# EAGLE design 100Wdriver (EAGLE 6.2)
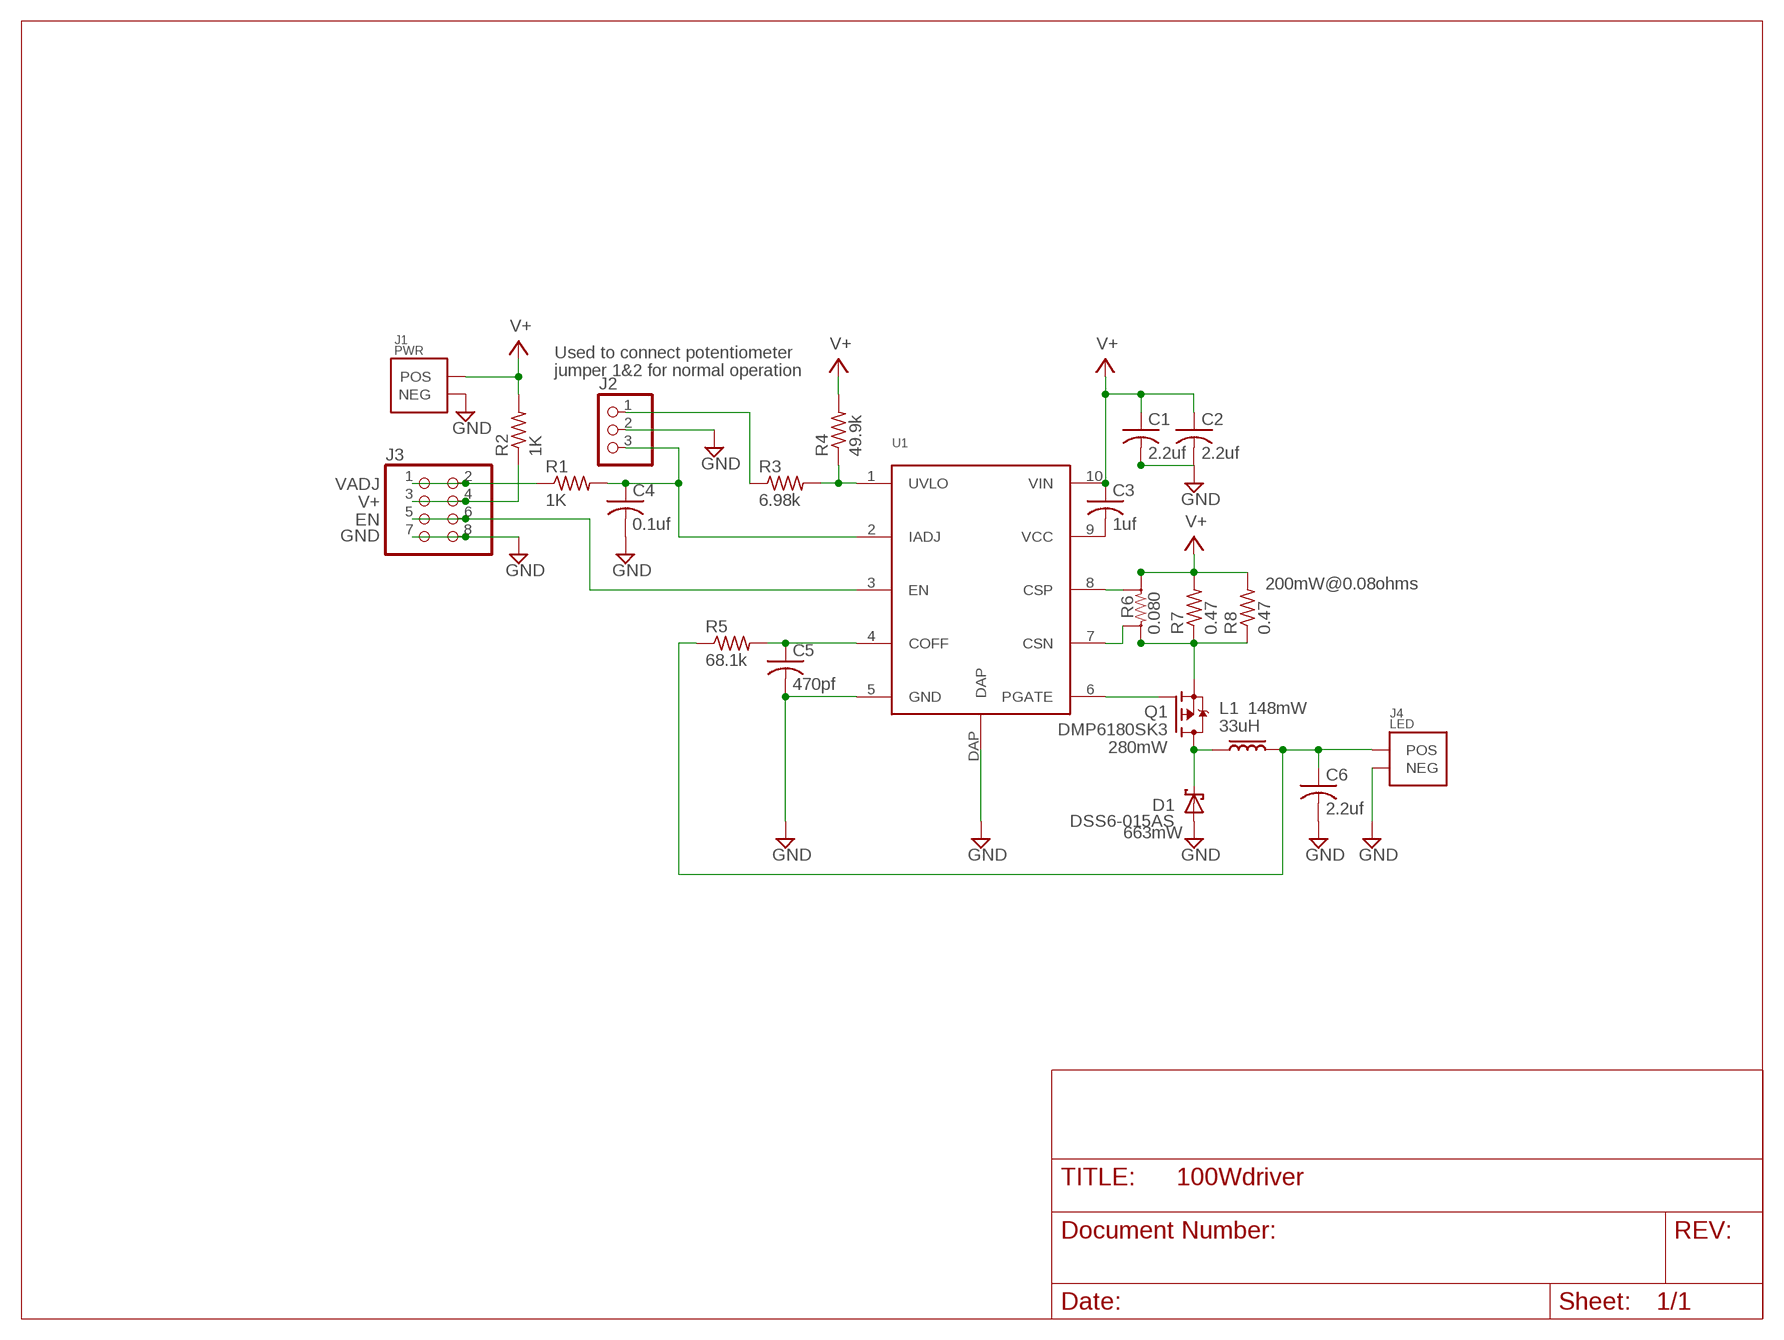
[diagram p0: schematic, sheet 1]

## Parts
C1  2.2uf  C-USC1210  [C1210]
C2  2.2uf  C-USC1210  [C1210]
C3  1uf  C-USC0805  [C0805]
C4  0.1uf  C-USC0805  [C0805]
C5  470pf  C-USC0805  [C0805]
C6  2.2uf  C-USC1210  [C1210]
D1  DSS6-015AS  BZW04XX  [D-PAK_TO252AA]
J1  PWR  TERMBLOCKLEFT  [3.5MMLEFT]
J2  PINHD-1X3  [1X03]
J3  PINHD-2X4  [2X04]
J4  LED  TERMBLOCK  [3.5MM]
L1  33uH  SDR2207  [SDR2207]
Q1  DMP6180SK3  FDD4141TO252  [TO252]
R1  1K  R-US_R0805  [R0805]
R2  1K  R-US_R0805  [R0805]
R3  6.98k  R-US_R0805  [R0805]
R4  49.9k  R-US_R0805  [R0805]
R5  68.1k  R-US_R0805  [R0805]
R6  0.080  RSNS2512  [2512SENSE]
R7  0.47  R-US_R1206  [R1206]
R8  0.47  R-US_R1206  [R1206]
U1  LM3409HV  [10VSSOP]

## Nets
EN: J3.5 J3.6 U1.3(EN)
GND: C1.2 C2.2 C4.2 C5.2 C6.2 D1.1(A) D1.3(A) J1.GND(NEG) J2.2 J3.7 J3.8 J4.NEGATIVE(NEG) U1.5(GND) U1.DAP
IADJ: C4.1 J2.3 R1.2 U1.2(IADJ)
N$1: Q1.2(S) R6.P$3 R6.P$4 R7.1 R8.1
N$2: C5.1 R5.2 U1.4(COFF)
N$3: R3.2 R4.1 U1.1(UVLO)
N$4: D1.4(C) L1.P$1 Q1.3(D)
N$5: C3.2 U1.9(VCC)
N$6: Q1.1(G) U1.6(PGATE)
N$7: C6.1 J4.POSITIVE(POS) L1.P$2 R5.1
N$8: J3.1 J3.2 R1.1
N$10: J2.1 R3.1
N$11: J3.3 J3.4 R2.1
N$31: R6.SNS1 U1.8(CSP)
N$32: R6.SNS2 U1.7(CSN)
V+: C1.1 C2.1 C3.1 J1.V+(POS) R2.2 R4.2 R6.P$1 R6.P$2 R7.2 R8.2 U1.10(VIN)

## Notes on the sheet
- Used to connect potentiometer
- jumper 1&2 for normal operation
- VADJ
- V+
- EN
- GND
- 200mW@0.08ohms
- 148mW
- 280mW
- 663mW

## Library data of the parts
C1-C6 = rcl:C-US: CAPACITOR, American symbol
D1 = DIODEDPAK:BZW04XX: DIODE
J1 = CON- TERM 3.5mm:TERMBLOCKLEFT
J2 = pinhead:PINHD-1X3: PIN HEADER
J3 = pinhead:PINHD-2X4: PIN HEADER
J4 = CON- TERM 3.5mm:TERMBLOCK
L1 = INDSDR2207:SDR2207
Q1 = transistor-fet:FDD4141: P-Channel PowerTrench® MOSFET Source: FDD4141.pdf
R1-R5 R7 R8 = rcl:R-US_: RESISTOR, American symbol
R6 = R2512SNS:RSNS2512
U1 = LM3409HV:LM3409HV

## Board
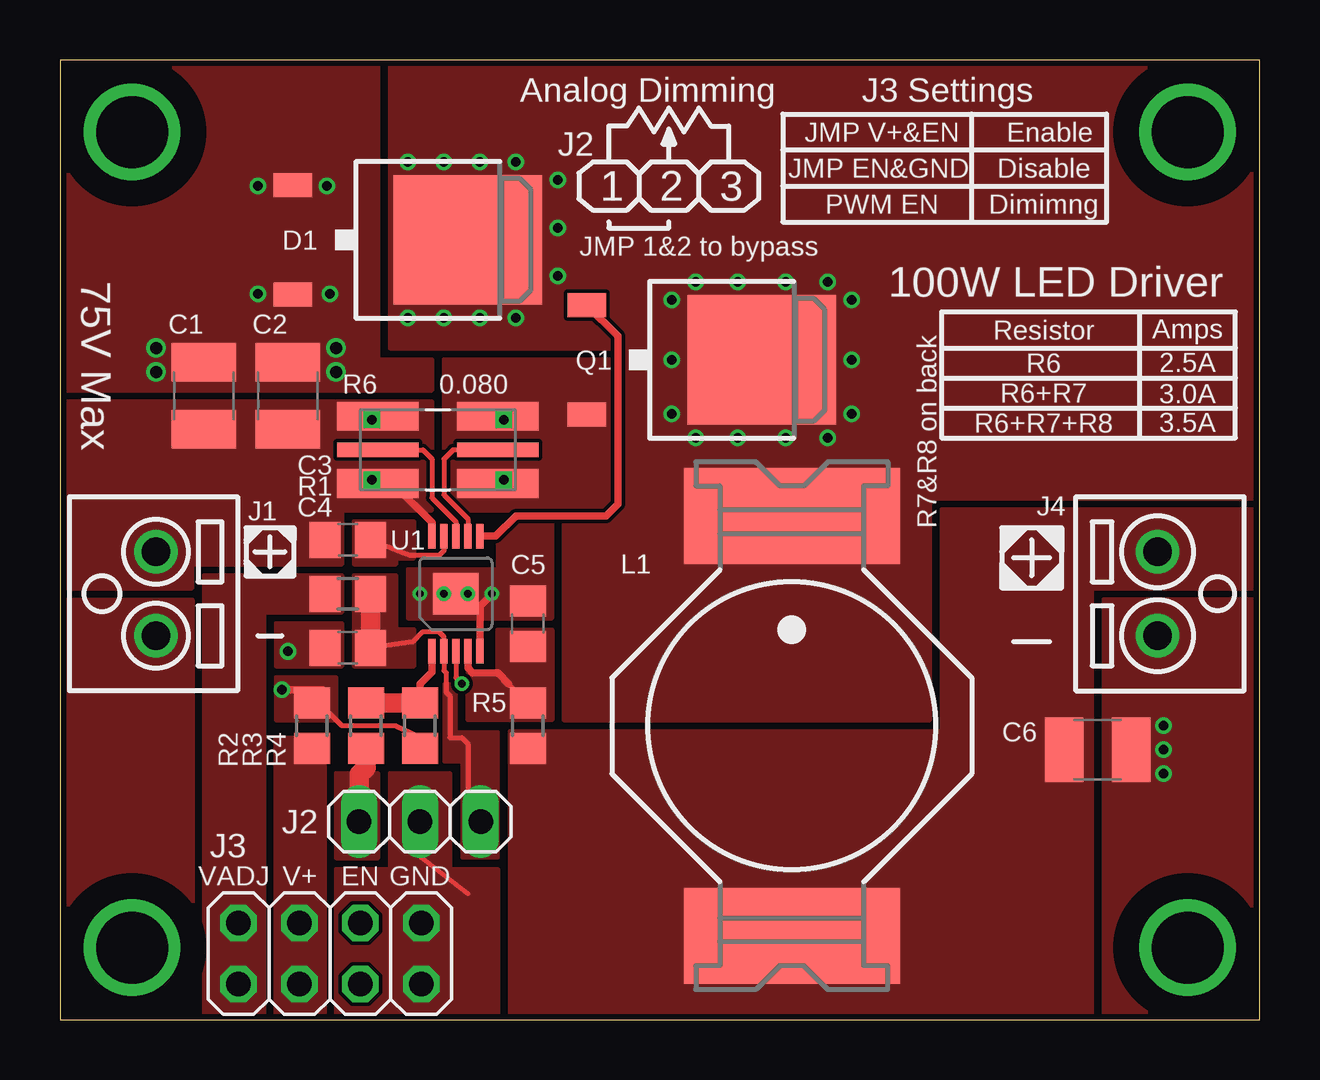
[diagram p1: board, top side]
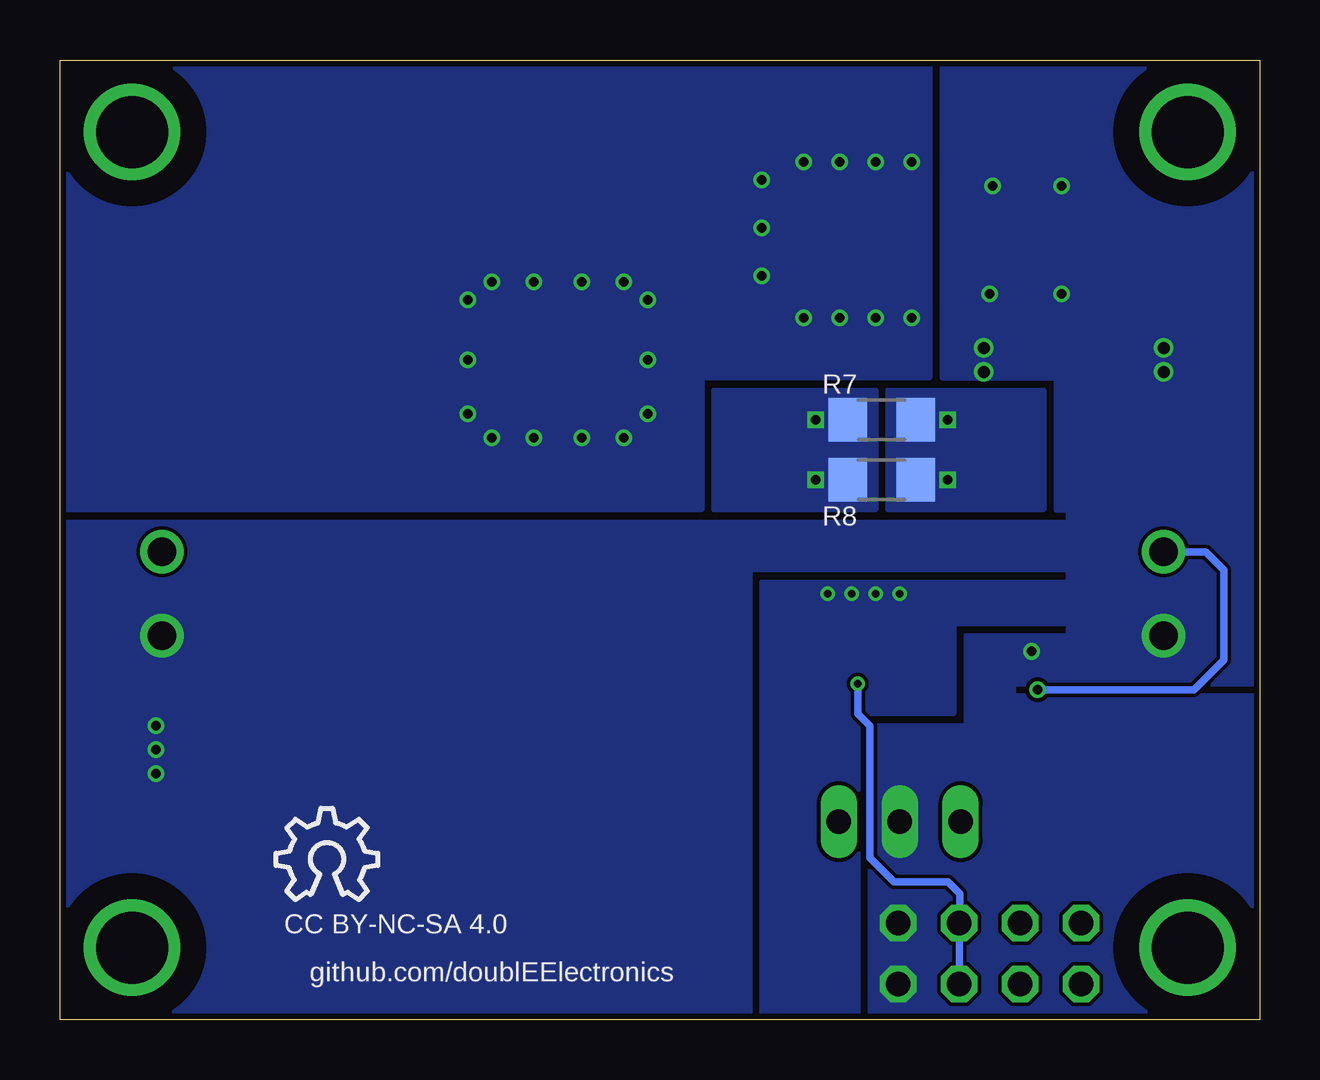
[diagram p2: board, bottom side, seen from below]

Size 50 x 40 mm. Coordinates in mm from the lower left corner, seen from the top.
Outline: 0,0 50,0 50,40 0,40 0,0
Copper layers (1*16): Top 0.035mm / dielectric 1.5mm / Bottom 0.035mm
Design rules: minimum track width 6mil, minimum drill 12mil, track to track 6mil, track to pad 6mil, pad to pad 6mil, via to via 6mil, smd to smd 0mil, copper to edge 10mil, drill to drill 10mil, minimum pad ring 10mil, minimum via ring 6mil, stop-mask expansion 2mil, vias tented up to drill 100mil, thermal gap 10mil
tRestrict: area 0,34 to 6,40; area 44,34 to 50,40; area 44,0 to 50,6; area 0,0 to 6,6
bRestrict: area 0,34 to 6,40; area 44,34 to 50,40; area 44,0 to 50,6; area 0,0 to 6,6

### Footprints (pad centres in the part's own frame; a part is rotated, then mirrored left to right if it is on the bottom)
C1210 = smd 1.6 x 2.7: 1 -1.4,0; 2 1.4,0
C0805 = smd 1.3 x 1.5: 1 -0.95,0; 2 0.95,0
D-PAK_TO252AA = smd 1 x 1.6: 1 -2.28,-4.8; 3 2.28,-4.8 | smd 5.4 x 6.2: 4 0,2.5
3.5MMLEFT = drill 1.2: GND 1.75,0; V+ -1.75,0
1X03 = drill 1.016 long: 1 -2.54,0; 2 0,0; 3 2.54,0
2X04 = drill 1.016 octagon: 1 -3.81,-1.27; 2 -3.81,1.27; 3 -1.27,-1.27; 4 -1.27,1.27; 5 1.27,-1.27; 6 1.27,1.27; 7 3.81,-1.27; 8 3.81,1.27
3.5MM = drill 1.2: NEGATIVE -1.75,0; POSITIVE 1.75,0
SDR2207 = smd 4 x 9: P$1 -8.75,0; P$2 8.75,0
TO252 = smd 1 x 1.6: 1 -2.28,-4.8; 2 2.28,-4.8 | smd 5.4 x 6.2: 3 0,2.5
R0805 = smd 1.3 x 1.5: 1 -0.95,0; 2 0.95,0
2512SENSE = smd 3.4 x 1.2: P$1 -2.5,1.4; P$2 -2.5,-1.4; P$3 2.5,1.4; P$4 2.5,-1.4 | smd 3.4 x 0.6: SNS1 -2.5,0; SNS2 2.5,0
R1206 = smd 1.6 x 1.803: 1 -1.422,0; 2 1.422,0
10VSSOP = smd 0.3 x 1.02: 1 -1,-2.4; 2 -0.5,-2.4; 3 0,-2.4; 4 0.5,-2.4; 5 1,-2.4; 6 1,2.4; 7 0.5,2.4; 8 0,2.4; 9 -0.5,2.4; 10 -1,2.4 | smd 1.9 x 1.73: DAP 0,0

### Placement (x,y rotation side)
C1  6,26 90 top
C2  9.5,26 90 top
C3  12,20 0 top
C4  12,15.5 180 top
C5  19.5,16.5 90 top
C6  43.25,11.25 0 top
D1  14.5,32.5 270 top
J1  4,17.75 270 top
J2  15,8.25 0 top
J3  11.25,2.75 0 top
J4  45.75,17.75 90 top
L1  30.5,12.25 270 top
Q1  26.75,27.5 270 top
R1  12,17.75 0 top
R2  10.5,12.25 90 top
R3  12.75,12.25 90 top
R4  15,12.25 270 top
R5  19.5,12.25 90 top
R6  15.75,23.75 0 top
R7  15.75,25 0 bottom
R8  15.75,22.5 0 bottom
U1  16.5,17.75 0 top
U$1  [OSHW_8X150_NOTEXT]  41,5 0 bottom

### Tracks (layer width: path | path; a pad name or v marks a point on that pad's centre or on a via)
EN  (via drill 0.3)
  Top 0.203: U1.3 16.5,14.25 v16.75,14
  Bottom 0.305: v16.75,14 16.75,12.75 16.25,12.25 16.25,6.75 15.25,5.75 13,5.75 12.5,5.25 12.5,4.04 J3.6 J3.5
GND  (via drill 0.3, 0.4, 0.4 pad 0.3, 0.5)
  Top 0.203: J2.2 14.75,7 17,5.25
  Top 0.305: U1.5 17.5,17.25 v18,17.75
  other vias: 15,17.75 16,17.75 17,17.75 4,28 4,27 46,12.25 46,11.25 46,10.25 9.5,15.35 11.5,27 11.5,28 8.25,34.75 11.12,34.75 8.25,30.25 11.25,30.25
  pour Top (no thermals): 14.5,18.75 14.5,16.75 20.5,16.75 20.5,20.75 18.25,20.75 18.25,18.75
  pour Top (no thermals): 0,26.25 15.5,26.25 15.5,27.5 13.25,27.5 13.25,40 0,40
  pour Top (no thermals): 43.5,17.5 43.5,0 50.04,0 50.04,17.5
  pour Top (no thermals): 9.75,16.5 9.75,15 11.75,15 11.75,16.5
  pour Top (no thermals): 0.25,17.5 5.5,17.5 5.5,0 0.25,0
  pour Top (no thermals): 13.75,6.25 11.5,6.25 11.5,0.25 16.25,0.25 16.25,10.25 13.75,10.25
  pour Top (no thermals): 16,6.25 16,0.25 18.25,0.25 18.25,6.25
  pour Bottom: 0,40 13.25,40 13.25,26.75 0,26.75
  pour Bottom (no thermals): 8,14 0,14 0,27.25 8.5,27.25 8.5,21.25 8,21.25
  pour Bottom: 7.75,16 10.75,16 10.75,14 7.75,14
  pour Bottom: 7.75,16.5 20.75,16.5 20.75,18.25 7.75,18.25
  pour Bottom (no thermals): 7.75,18.75 21.25,18.75 21.25,0 50.04,0 50.04,20.75 7.5,20.75
  pour Bottom (no thermals): 10.25,16 12.25,16 12.25,12.25 16.25,12.25 16.25,0 0,0 0,13.5 10.25,13.5
  pour Bottom (no thermals): 12.75,17.75 12.75,12.75 16.75,12.75 16.75,0 20.75,0 20.75,17.75
  pour Top (no thermals): 9,16.5 9,14.75 11.75,14.75 11.75,16.5
IADJ
  Top 0.203: C4.1 14.7,15.75 15.1,16.15 15.8,16.15 16,15.95 U1.2 16,14.55 16.1,14.45 16.1,13.65 16.25,13.5 16.25,11.75 16.75,11.75 17,11.5 17,9.54 J2.3
  Top 0.813: C4.1 R1.2
  pour Top (no thermals): 12.25,18.5 12.25,14.75 14.75,14.75 14.75,16.25 14,16.25 14,18.5
  pour Top (no thermals): 16.75,6.75 18.25,6.75 18.25,12 16.5,12 16.5,14 16,14 16,10.75 16.75,10.75
N$1  (via drill 0.4)
  other vias: 18.5,22.5 18.5,25
  pour Bottom (no thermals): 16,26.25 16,21.25 22.75,21.25 22.75,26.25
  pour Top (no thermals): 16,27.5 16,21.25 23.25,21.25 23.25,27.5
N$2
  Top 0.203: 18.7,14 R5.2
  Top 0.305: U1.4 17,14.65 17.2,14.45 18.25,14.45 18.7,14
  pour Top (no thermals): 18.25,16.25 20.5,16.25 20.5,12.5 17,12.5 17,14.5 18.25,14.5
N$3
  Top 0.305: R4.1 15,14 15.5,14.5 U1.1
  Top 0.813: R4.1 R3.2
N$4  (via drill 0.4)
  other vias: 25.5,30 25.5,27.5 25.5,25.25 33,25.25 33,27.5 33,30 26.5,30.75 28.25,30.75 30.25,30.75 32,30.75 32,24.25 30.25,24.25 28.25,24.25 26.5,24.25 14.5,35.75 16,35.75 17.5,35.75 19,35.75 19,29.25 17.5,29.25 16,29.25 14.5,29.25 20.75,35 20.75,31 20.75,33
  pour Top (no thermals): 21,12.5 36.25,12.5 36.25,21.75 50.04,21.75 50.04,40.08 13.75,40.08 13.75,28 23,28 23,20.75 21,20.75
  pour Bottom: 13.75,26.75 23.25,26.75 23.25,21.25 50.04,21.25 50.04,40.08 13.75,40.08
N$5
  Top 0.203: U1.9 16,19.55 15.8,19.35 14.6,19.35 14.2,19.5 C3.2
  pour Top (no thermals): 12.25,19 14,19 14,19.25 14.75,19.25 14.75,20.75 12.25,20.75
N$6
  Top 0.305: U1.6 18.15,20.15 19,21 22.75,21 23.25,21.5 23.25,28.48 Q1.1
N$7
  pour Top (no thermals): 43,0 43,18 50.04,18 50.04,21.25 36.75,21.25 36.75,12 18.75,12 18.75,0
N$8
  Top 0.406: 11.5,17.75 R1.1
  pour Top (no thermals): 11.75,18.5 6,18.5 6,0.25 8.5,0.25 8.5,17 11.75,17
N$9  (via drill 3 pad 3.2)
  other vias: 3,3
N$10
  Top 0.813: J2.1 12.46,10.21 12.75,10.5 R3.1
  pour Top (no thermals): 11.5,6.75 13.25,6.75 13.25,10.25 11.5,10.25
N$11
  pour Top (no thermals): 9,0.25 9,11.75 11,11.75 11,0.25
N$15  (via drill 3 pad 3.2)
  other vias: 3,37
N$25  (via drill 3 pad 3.2)
  other vias: 47,37
N$26  (via drill 3 pad 3.2)
  other vias: 47,3
N$31
  Top 0.203: R6.SNS1 15.12,23.75 15.5,23.38 15.5,21.75 16.5,20.75 U1.8
N$32
  Top 0.203: R6.SNS2 16.38,23.75 16,23.38 16,21.88 17,20.88 U1.7
V+  (via drill 0.4, 0.4 pad 0.3)
  Top 0.203: R4.2 14.95,11.8 14,12.25 11.75,12.25 11,13 10.5,13 9.75,13.75 | 10.95,13.75 R2.2
  Top 0.305: U1.10 15.5,20.73 13.98,22.25 v13,22.5 | R2.2 11.05,13.7 | v9.25,13.75 9.75,13.75 10.95,13.75
  Bottom 0.305: v9.25,13.75 2.75,13.75 1.5,15 1.5,18.75 2.25,19.5 J1.V+
  other vias: 13,25
  pour Bottom (no thermals): 9,26.25 9,21.25 15.5,21.25 15.5,26.25
  pour Top (no thermals): 12,25.75 12,21.75 14.5,21.75 14.5,25.75
  pour Top (no thermals): 15.5,21.25 15.5,25.75 0.25,25.75 0.25,18 5.5,18 5.5,19 11.75,19 11.75,21.25
  pour Top (no thermals): 9,14.25 9,12.5 11.5,12.5 11.5,14.25

### Text on the board
tNames: Analog Dimming | J3 Settings | JMP V+&EN | Enable | J2 | JMP EN&GND | Disable | 1 | 2 | 3 | PWM EN | Dimimng | JMP 1&2 to bypass | 100W LED Driver | Resistor | Amps | 75V Max | R6 | 2.5A | R6+R7 | 3.0A | R6+R7+R8 | 3.5A | R7&R8 on back | VADJ | V+ | EN | GND
bNames: CC BY-NC-SA 4.0 | github.com/doublEElectronics